# Altium schematic sheet Grid_Eye_SCH.SchDoc
size A4
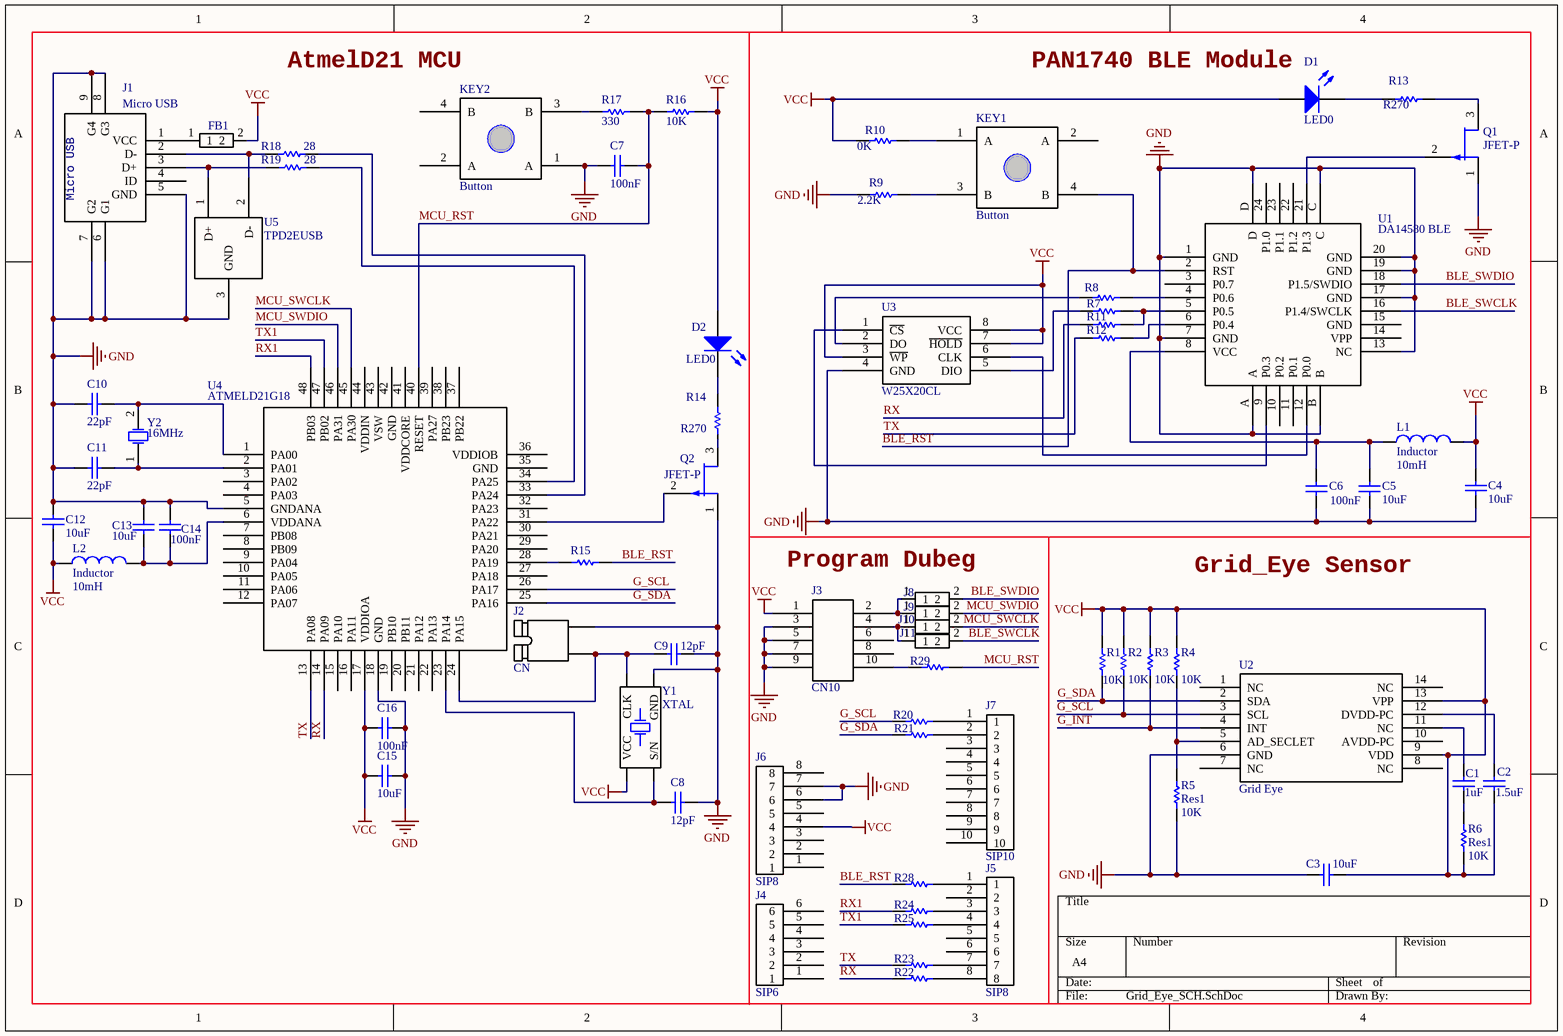
[diagram p0: Grid_Eye_SCH.SchDoc]

## Parts
C1  value 1uF  [1608[0603]]  (hidden comment: Cap Semi)
C2  value 1.5uF  [1608[0603]]  (hidden comment: Cap Semi)
C3  value 10uF  [C1206]  (hidden comment: Cap Semi)
C4  value 10uF  [C1206]  (hidden comment: Cap Semi)
C5  value 10uF  [C1206]  (hidden comment: Cap Semi)
C6  value 100nF  [1608[0603]]  (hidden comment: Cap Semi)
C7  value 100nF  [1608[0603]]  (hidden comment: Cap Semi)
C8  value 12pF  [0402]  (hidden comment: Cap Semi)
C9  value 12pF  [0402]  (hidden comment: Cap Semi)
C10  value 22pF  [0402]  (hidden comment: Cap Semi)
C11  value 22pF  [0402]  (hidden comment: Cap Semi)
C12  value 10uF  [C1206]  (hidden comment: Cap Semi)
C13  value 10uF  [C1206]  (hidden comment: Cap Semi)
C14  value 100nF  [0402]  (hidden comment: Cap Semi)
C15  value 10uF  [1608[0603]]  (hidden comment: Cap Semi)
C16  value 100nF  [0402]  (hidden comment: Cap Semi)
D1  LED0  [6-0805_N]
D2  LED0  [6-0805_N]
FB1  SIP2  [6-0805_M]  (value not drawn)
J1  Micro USB  [Micro USB]
J2  CN  [CN2]
J3  CN10  [CN10]
J4  SIP6  [SIP6]
J5  SIP8  [SIP8]
J6  SIP8  [SIP8]
J7  SIP10  [SIP10]
J8  SIP2  [SIP2]  (value not drawn)
J9  SIP2  [SIP2]  (value not drawn)
J10  SIP2  [SIP2]  (value not drawn)
J11  SIP2  [SIP2]  (value not drawn)
KEY1  Button  [My_Button]
KEY2  Button  [My_Button]
L1  Inductor  value 10mH  [INDC3216]
L2  Inductor  value 10mH  [INDC3216]
Q1  JFET-P  [TO-18A]
Q2  JFET-P  [TO-18A]
R1  value 10K  [6-0805_M]  (hidden comment: Res1)
R2  value 10K  [6-0805_M]  (hidden comment: Res1)
R3  value 10K  [6-0805_M]  (hidden comment: Res1)
R4  value 10K  [6-0805_M]  (hidden comment: Res1)
R5  Res1  value 10K  [6-0805_M]
R6  Res1  value 10K  [6-0805_M]
R7  Res1  [6-0805_M]  (value not drawn)
R8  Res1  [6-0805_M]  (value not drawn)
R9  value 2.2K  [6-0805_M]  (hidden comment: Res1)
R10  value 0K  [6-0805_M]  (hidden comment: Res1)
R11  Res1  [6-0805_M]  (value not drawn)
R12  Res1  [6-0805_M]  (value not drawn)
R13  value R270  [6-0805_M]  (hidden comment: Res1)
R14  value R270  [6-0805_M]  (hidden comment: Res1)
R15  Res1  [6-0805_M]  (value not drawn)
R16  value 10K  [6-0805_M]  (hidden comment: Res1)
R17  value 330  [6-0805_M]  (hidden comment: Res1)
R18  value 28  [6-0805_M]  (hidden comment: Res1)
R19  value 28  [6-0805_M]  (hidden comment: Res1)
R20  Res1  [6-0805_M]  (value not drawn)
R21  Res1  [6-0805_M]  (value not drawn)
R22  Res1  [6-0805_M]  (value not drawn)
R23  Res1  [6-0805_M]  (value not drawn)
R24  Res1  [6-0805_M]  (value not drawn)
R25  Res1  [6-0805_M]  (value not drawn)
R28  Res1  [6-0805_M]  (value not drawn)
R29  Res1  [6-0805_M]  (value not drawn)
U1  DA14580 BLE  [PAN1740]
U2  Grid Eye  [Grid_Eye_Sensor]
U3  W25X20CL  [SO8_L]
U4  ATMELD21G18  [TQPF48]
U5  TPD2EUSB  [TPDEUSB30]
Y1  XTAL  [xtal1]
Y2  16MHz  [XTAL]

## Nets
GND: C3.2 C4.1 C5.2 C6.1 C7.2 C8.2 C9.2 C10.1 C11.1 C12.2 C13.2 C14.2 C15.1 C16.1 J1.5(GND) J1.6(G1) J1.7(G2) J1.8(G3) J1.9(G4) J2.2 J3.3 J3.5 J3.7 J3.9 J6.6 J6.7 KEY2.1(A) Q1.1(D) Q2.1(D) R5.1 R9.2 U1.1(GND) U1.7(GND) U1.13(NC) U1.17(GND) U1.19(GND) U1.20(GND) U1.A U1.B U1.C U1.D U2.6(GND) U3.4(GND) U4.5(GNDANA) U4.18(GND) U5.3(GND) Y1.2(GND)
VCC: C2.1 C3.1 C4.2 C12.1 C15.2 C16.2 D1.1(A) D2.1(A) FB1.2 J3.1 J6.4 L1.2 L2.1 R1.2 R2.2 R3.2 R4.2 R6.1 R10.2 R16.1 U2.9(VDD) U2.13(VPP) U3.3(~{WP}) U3.7(~{HOLD}) U3.8(VCC) U4.17(VDDIOA) Y1.4(VCC)
BLE_RST: KEY1.4(B) R15.2 R28.2 U1.2(RST)
BLE_SWCLK: J11.2 U1.16(P1.4/SWCLK)
BLE_SWDIO: J8.2 U1.18(P1.5/SWDIO)
G_INT: R3.1 U2.4(INT)
G_SCL: R2.1 R20.2 U2.3(SCL) U4.26(PA17)
G_SDA: R1.1 R21.2 U2.2(SDA) U4.25(PA16)
MCU_RST: C7.1 R16.2 R17.1 R29.1 U4.40(RESET)
MCU_SWCLK: J10.2 U4.45(PA30)
MCU_SWDIO: J9.2 U4.46(PA31)
RX: R11.2 R22.2 U4.14(PA09)
RX1: R24.2 U4.48(PB03)
TX: R12.2 R23.2 U4.13(PA08)
TX1: R25.2 U4.47(PB02)
NetC1_1: C1.1 R6.2
NetC1_2: C1.2 U2.11(NC)
NetC2_2: C2.2 U2.12(DVDD-PC)
NetC5_1: C5.1 C6.2 L1.1 U1.8(VCC)
NetC8_1: C8.1 U4.23(PA14) Y1.1(S/N)
NetC9_1: C9.1 J2.1 U4.24(PA15) Y1.3(CLK)
NetC10_2: C10.2 U4.1(PA00) Y2.2
NetC11_2: C11.2 U4.2(PA01) Y2.1
NetC13_1: C13.1 C14.1 L2.2 U4.6(VDDANA)
NetD1_2: D1.2(K) R13.2
NetD2_2: D2.2(K) R14.1
NetFB1_1: FB1.1 J1.1(VCC)
NetJ1_2: J1.2(D-) R18.2 U5.2(D-)
NetJ1_3: J1.3(D+) R19.2 U5.1(D+)
NetJ3_2: J3.2 J8.1 J9.1
NetJ3_4: J3.4 J10.1 J11.1
NetJ3_10: J3.10 R29.2
NetJ5_1: J5.1 R28.1
NetJ5_3: J5.3 R24.1
NetJ5_4: J5.4 R25.1
NetJ5_7: J5.7 R23.1
NetJ5_8: J5.8 R22.1
NetJ7_1: J7.1 R20.1
NetJ7_2: J7.2 R21.1
NetKEY1_1: KEY1.1(A) R10.1
NetKEY1_3: KEY1.3(B) R9.1
NetKEY2_3: KEY2.3(B) R17.2
NetQ1_2: Q1.2(G) U1.21(P1.3)
NetQ1_3: Q1.3(S) R13.1
NetQ2_2: Q2.2(G) U4.31(PA22)
NetQ2_3: Q2.3(S) R14.2
NetR4_1: R4.1 R5.2 U2.5(AD_SECLET)
NetR7_1: R7.1 R11.1 U1.5(P0.5)
NetR7_2: R7.2 U3.5(DIO)
NetR8_1: R8.1 U1.4(P0.6)
NetR8_2: R8.2 U3.2(DO)
NetR12_1: R12.1 U1.6(P0.4)
NetR15_1: R15.1 U4.28(PA19)
NetR18_1: R18.1 U4.33(PA24)
NetR19_1: R19.1 U4.34(PA25)
NetU1_9: U1.9(P0.3) U3.1(~{CS})
NetU1_12: U1.12(P0.0) U3.6(CLK)

Not connected (* = marked no-connect by the designer): J1 4(ID); J3 6 8; J4 1 2 3 4 5 6; J5 2 5 6; J6 1 2 3 5 8; J7 3 4 5 6 7 8 9 10; KEY1 2(A); KEY2 2(A) 4(B); U1 3(P0.7) 10(P0.2) 11(P0.1) 14(VPP) 15(GND) 22(P1.2) 23(P1.1) 24(P1.0); U2 1(NC) 7(NC) 8(NC) 10(AVDD-PC) 14(NC); U4 3(PA02) 4(PA03) 7(PB08) 8(PB09) 9(PA04) 10(PA05) 11(PA06) 12(PA07) 15(PA10) 16(PA11) 19(PB10) 20(PB11) 21(PA12) 22(PA13) 27(PA18) 29(PA20) 30(PA21) 32(PA23) 35(GND) 36(VDDIOB) 37(PB22) 38(PB23) 39(PA27) 41(VDDCORE) 42(GND) 43(VSW) 44(VDDIN)

## Notes on the sheet
- (near KEY2) AtmelD21 MCU
- PAN1740 BLE Module
- Program Dubeg
- Grid_Eye Sensor

## Library data of the parts
C1-C16 = Cap Semi: Capacitor (Semiconductor SIM Model); Published: 8-Jun-2000; LatestRevisionDate: 29-May-2009; LatestRevisionNote: IPC-7351 Footprint Added.; PackageReference: C1206; Publisher: Altium Limited; PackageDescription: Chip Capacitor
D1 D2 = LED0: Typical INFRARED GaAs LED; Published: 8-Jun-2000; LatestRevisionDate: 08-Jul-2005; LatestRevisionNote: Mech Layer 1 removed.; PackageReference: LED-0; Publisher: Altium Limited; PackageDescription: LED; 2 Leads
J1 = Micro USB 5P
J2 = CN2: My CN2
J3 = CN10: My CN10
KEY1 KEY2 = My_Button: My Button
L1 L2 = Inductor: Code_IEC: 1005; Published: 8-Jun-2000; LatestRevisionDate: 29-May-2009; LatestRevisionNote: IPC-7351 Footprint Added.; PackageReference: 0402-A; Publisher: Altium Limited; PackageDescription: Chip Inductor; Code_JEITA: 0402
Q1 Q2 = JFET-P: P-Channel JFET; Published: 8-Jun-2000; LatestRevisionDate: 17-Jul-2002; LatestRevisionNote: Re-released for DXP Platform.; PackageReference: TO-18A; Publisher: Altium Limited; PackageDescription: SC-89; 3 Flat Leads; Body 1.6 x 1.6 x 0.7 mm, inc leads (LxWxH typ)
R1-R6 R9 R10 R13 R14 R16-R19 = Res1: Resistor; Published: 8-Jun-2000; LatestRevisionDate: 17-Jul-2002; LatestRevisionNote: Re-released for DXP Platform.; PackageReference: AXIAL-0.3; Publisher: Altium Limited; PackageDescription: Axial Device, Thru-Hole; 2 Leads; 0.3 in Pin Spacing
R7 R8 R11 R12 = Res1: Resistor; Value: 0K; Published: 8-Jun-2000; LatestRevisionDate: 17-Jul-2002; LatestRevisionNote: Re-released for DXP Platform.; PackageReference: AXIAL-0.3; Publisher: Altium Limited; PackageDescription: Axial Device, Thru-Hole; 2 Leads; 0.3 in Pin Spacing
R15 R20-R25 R28 R29 = Res1: Resistor; Value: 0; Published: 8-Jun-2000; LatestRevisionDate: 17-Jul-2002; LatestRevisionNote: Re-released for DXP Platform.; PackageReference: AXIAL-0.3; Publisher: Altium Limited; PackageDescription: Axial Device, Thru-Hole; 2 Leads; 0.3 in Pin Spacing
U1 = PAN1740: DA14580 BLE MODULE
U2 = Grid_Eye_Sensor: Grid Eye Sensor
U4 = AtmelD21G18A
U5 = TPD2EUSB30
Y1 = XATL1
Y2 = XTAL